# Altium schematic sheet main.SchDoc
size B; SheetNumber: 1; SheetTotal: 1
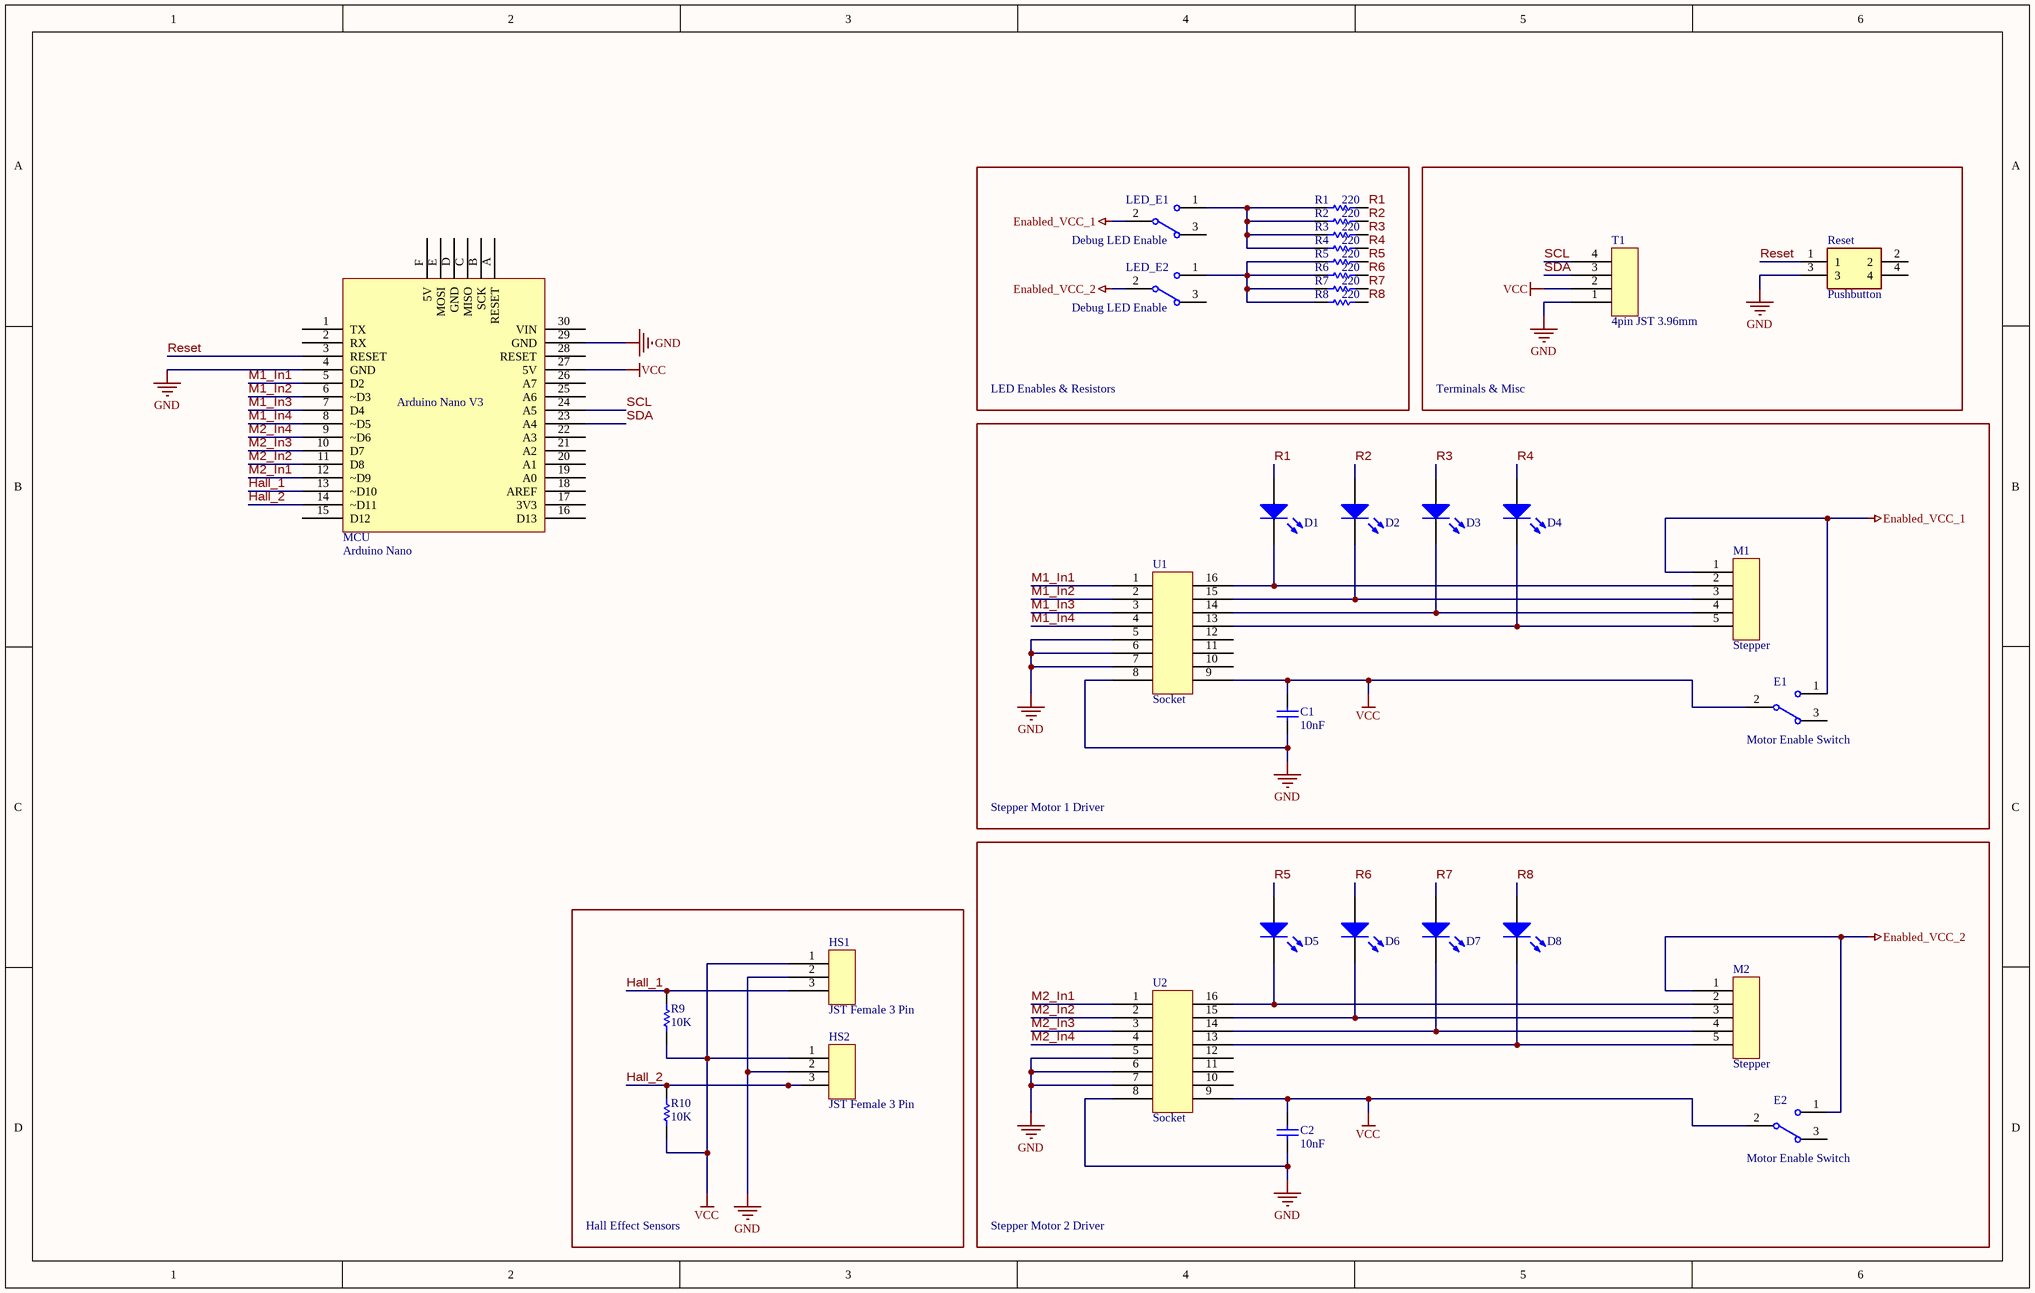
[diagram p0: main.SchDoc]

## Parts
C1  Capacitance: 10nF  [Nonpolarized cap]  (hidden comment: Thru-Hole Cap)
C2  Capacitance: 10nF  [Nonpolarized cap]  (hidden comment: Thru-Hole Cap)
D1  LED  [Small Blue LED]  (value not drawn)
D2  LED  [Small Green LED]  (value not drawn)
D3  LED  [Small Orange LED]  (value not drawn)
D4  LED  [Small Yellow LED]  (value not drawn)
D5  LED  [Small Blue LED]  (value not drawn)
D6  LED  [Small Green LED]  (value not drawn)
D7  LED  [Small Orange LED]  (value not drawn)
D8  LED  [Small Yellow LED]  (value not drawn)
E1  Motor Enable Switch  [SPDT Switch]
E2  Motor Enable Switch  [SPDT Switch]
HS1  JST Female 3 Pin  [Jst Female 3pin]
HS2  JST Female 3 Pin  [Jst Female 3pin]
LED_E1  Debug LED Enable  [SPDT Switch]
LED_E2  Debug LED Enable  [SPDT Switch]
M1  Stepper  [JST Female 5pin]
M2  Stepper  [JST Female 5pin]
MCU  Arduino Nano  [Arduino Nano]
R1  value 220  [AXIAL-0.3]  (hidden comment: Res1)
R2  value 220  [AXIAL-0.3]  (hidden comment: Res1)
R3  value 220  [AXIAL-0.3]  (hidden comment: Res1)
R4  value 220  [AXIAL-0.3]  (hidden comment: Res1)
R5  value 220  [AXIAL-0.3]  (hidden comment: Res1)
R6  value 220  [AXIAL-0.3]  (hidden comment: Res1)
R7  value 220  [AXIAL-0.3]  (hidden comment: Res1)
R8  value 220  [AXIAL-0.3]  (hidden comment: Res1)
R9  value 10K  [AXIAL-0.3]  (hidden comment: Res1)
R10  value 10K  [AXIAL-0.3]  (hidden comment: Res1)
Reset  Pushbutton  [FSM4JH]
T1  4pin JST 3.96mm  [JST VH 3.96mm 4pin Female Connector]
U1  Socket  [16pin DIP IC Socket]
U2  Socket  [16pin DIP IC Socket]

## Blocks framed on the sheet
LED Enables & Resistors: LED_E1 LED_E2 R1-R8
Terminals & Misc: Reset T1
Stepper Motor 1 Driver: C1 D1-D4 E1 M1 U1
Stepper Motor 2 Driver: C2 D5-D8 E2 M2 U2
Hall Effect Sensors: HS1 HS2 R9 R10

## Nets
Enabled_VCC_1: E1.1 LED_E1.2 M1.1
Enabled_VCC_2: E2.1 LED_E2.2 M2.1
GND: C1.1 C2.1 HS1.2 HS2.2 MCU.4(GND) MCU.29(GND) Reset.3 T1.1 U1.5 U1.6 U1.7 U1.8 U2.5 U2.6 U2.7 U2.8
VCC: C1.2 C2.2 E1.2 E2.2 HS1.1 HS2.1 MCU.27(5V) R9.2 R10.2 T1.2 U1.9 U2.9
Hall_1: HS1.3 MCU.13(~D10) R9.1
Hall_2: HS2.3 MCU.14(~D11) R10.1
M1_In1: MCU.5(D2) U1.1
M1_In2: MCU.6(~D3) U1.2
M1_In3: MCU.7(D4) U1.3
M1_In4: MCU.8(~D5) U1.4
M2_In1: MCU.12(~D9) U2.1
M2_In2: MCU.11(D8) U2.2
M2_In3: MCU.10(D7) U2.3
M2_In4: MCU.9(~D6) U2.4
R1: D1.1(A) R1.2
R2: D2.1(A) R2.2
R3: D3.1(A) R3.2
R4: D4.1(A) R4.2
R5: D5.1(A) R5.2
R6: D6.1(A) R6.2
R7: D7.1(A) R7.2
R8: D8.1(A) R8.2
Reset: MCU.3(RESET) Reset.1
SCL: MCU.24(A5) T1.4
SDA: MCU.23(A4) T1.3
NetD1_2: D1.2(K) M1.2 U1.16
NetD2_2: D2.2(K) M1.3 U1.15
NetD3_2: D3.2(K) M1.4 U1.14
NetD4_2: D4.2(K) M1.5 U1.13
NetD5_2: D5.2(K) M2.2 U2.16
NetD6_2: D6.2(K) M2.3 U2.15
NetD7_2: D7.2(K) M2.4 U2.14
NetD8_2: D8.2(K) M2.5 U2.13
NetLED_E1_1: LED_E1.1 R1.1 R2.1 R3.1 R4.1
NetLED_E2_1: LED_E2.1 R5.1 R6.1 R7.1 R8.1

Not connected (* = marked no-connect by the designer): E1 3; E2 3; LED_E1 3; LED_E2 3; MCU 1(TX) 2(RX) 15(D12) 16(D13) 17(3V3) 18(AREF) 19(A0) 20(A1) 21(A2) 22(A3) 25(A6) 26(A7) 28(RESET) 30(VIN) A(RESET) B(SCK) C(MISO) D(GND) E(MOSI) F(5V); Reset 2 4; U1 10 11 12; U2 10 11 12

## Notes on the sheet
- (in symbol Arduino Nano) Arduino Nano V3

## Library data of the parts
C1 C2 = Thru-Hole Cap: Nonpolarized capacitor
D1 D5 = Small LED: 3mm LED; Color: Blue
D2 D6 = Small LED: 3mm LED; Color: Green
D3 D7 = Small LED: 3mm LED; Color: Orange
D4 D8 = Small LED: 3mm LED; Color: Yellow
E1 E2 LED_E1 LED_E2 = SPDT Switch
M1 M2 = JST Female 5 Pin
R1-R10 = Res1: Resistor; Published: 8-Jun-2000; LatestRevisionDate: 17-Jul-2002; LatestRevisionNote: Re-released for DXP Platform.; PackageReference: AXIAL-0.3; Publisher: Altium Limited; PackageDescription: Axial Device, Thru-Hole; 2 Leads; 0.3 in Pin Spacing
Reset = Pushbutton: Switch; Manufacturer_Name: TE Connectivity; Manufacturer_Part_Number: FSM2JAH; Datasheet Link: http://www.te.com/commerce/DocumentDelivery/DDEController?Action=showdoc&DocId=Customer+Drawing%7F1825910%7FC9%7Fpdf%7FEnglish%7FENG_CD_1825910_C9.pdf%7F1825910-3; Mouser Part Number: 506-FSM2JAH; Mouser Price/Stock: https://www.mouser.co.uk/ProductDetail/TE-Connectivity-PB/FSM2JAH?qs=Of7OaoM7rsH02ckr%252BGLHNA%3D%3D
T1 = JST VH 3.96mm 4pin Female Connector
U1 U2 = 1-2199298-4: Integrated Circuit; Manufacturer_Name: TE Connectivity; Datasheet Link: https://www.te.com/commerce/DocumentDelivery/DDEController?Action=showdoc&DocId=Customer+Drawing%7F2199298%7FA%7Fpdf%7FEnglish%7FENG_CD_2199298_A_baseFilename.pdf%7F1-2199298-4; Height: 5.1mm; Manufacturer_Part_Number: 1-2199298-4; Mouser Part Number: 571-1-2199298-4; Mouser Price/Stock: https://www.mouser.co.uk/ProductDetail/TE-Connectivity/1-2199298-4?qs=fK8dlpkaUMvpL10rY9Abiw%3D%3D; Arrow Part Number: 1-2199298-4; Arrow Price/Stock: https://www.arrow.com/en/products/1-2199298-4/te-connectivity?region=nac